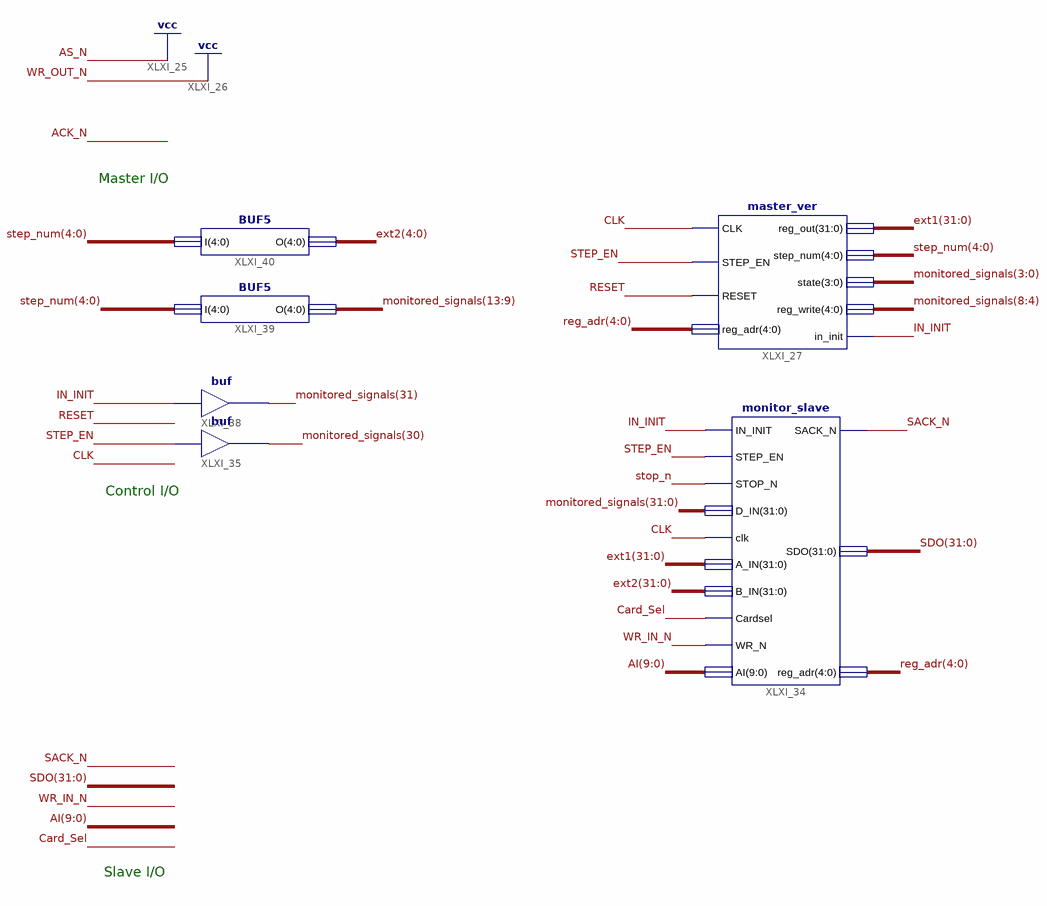
[diagram p0: schematic sheet 1]
// Xilinx ISE schematic TopLevel_monitor.sch (spartan6) as structural Verilog: 6 symbols, 0 ports
module TopLevel_monitor (
);

  wire Card_Sel, CLK, IN_INIT, RESET, SACK_N, STEP_EN, stop_n, WR_IN_N;
  wire [4:0] reg_adr, step_num;
  wire [9:0] AI;
  wire [31:0] ext1, ext2, monitored_signals, SDO;

  buf XLXI_35 (monitored_signals[30], STEP_EN);
  buf XLXI_38 (monitored_signals[31], IN_INIT);
  BUF5 XLXI_39 (.I(step_num), .O(monitored_signals[13:9]));
  BUF5 XLXI_40 (.I(step_num), .O(ext2[4:0]));
  master_ver XLXI_27 (
    .CLK(CLK), .STEP_EN(STEP_EN), .RESET(RESET), .reg_adr(reg_adr), .reg_out(ext1), .step_num(step_num),
    .state(monitored_signals[3:0]), .reg_write(monitored_signals[8:4]), .in_init(IN_INIT));
  monitor_slave XLXI_34 (
    .IN_INIT(IN_INIT), .STEP_EN(STEP_EN), .STOP_N(stop_n), .D_IN(monitored_signals), .clk(CLK), .A_IN(ext1),
    .B_IN(ext2), .Cardsel(Card_Sel), .WR_N(WR_IN_N), .AI(AI), .SACK_N(SACK_N), .SDO(SDO), .reg_adr(reg_adr));

  // Notes on the sheet:
  //   Master I/O
  //   Control I/O
  //   Slave I/O
endmodule
